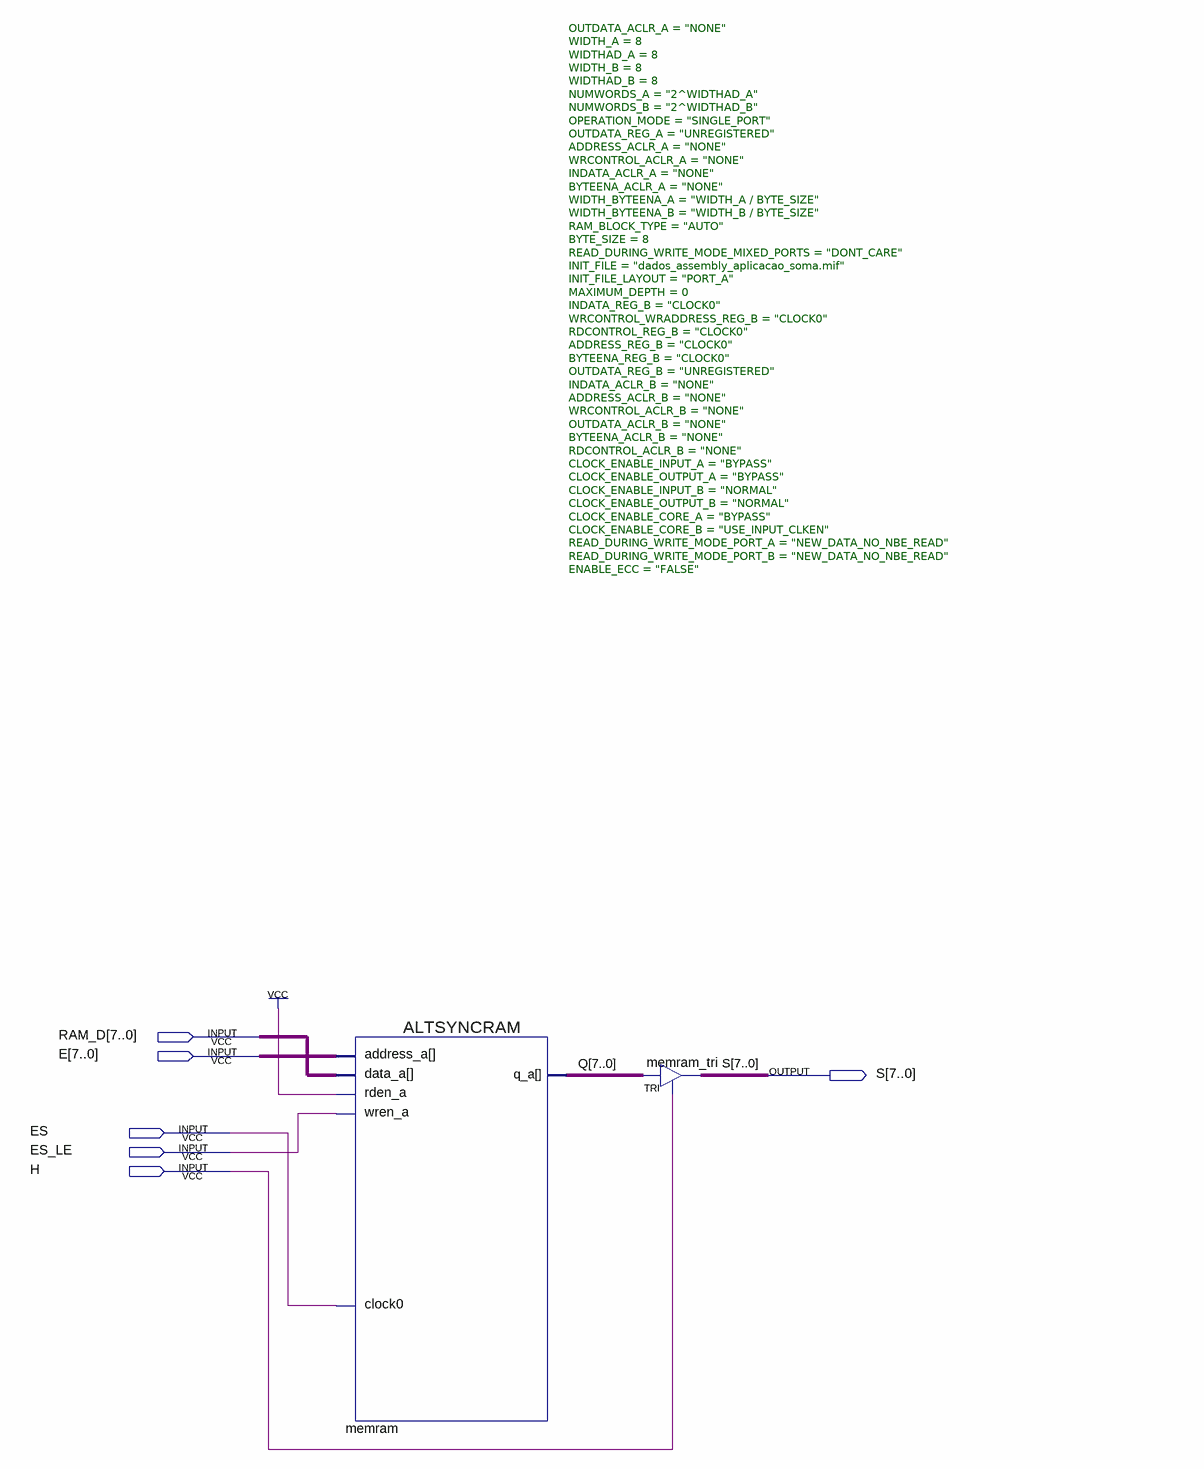
[diagram p0: schematic sheet]
// Quartus schematic RAM_MemoriaRAM.bdf as structural Verilog: 2 symbols, 6 pins
module RAM_MemoriaRAM (
  input  [7:0] RAM_D,
  input  [7:0] E,
  input  ES,
  input  ES_LE,
  input  H,
  output [7:0] S
);

  wire [7:0] Q;

  ALTSYNCRAM #(.OUTDATA_ACLR_A("NONE"), .WIDTH_A(8), .WIDTHAD_A(8), .WIDTH_B(8), .WIDTHAD_B(8), .NUMWORDS_A("2^WIDTHAD_A"), .NUMWORDS_B("2^WIDTHAD_B"), .OPERATION_MODE("SINGLE_PORT"), .OUTDATA_REG_A("UNREGISTERED"), .ADDRESS_ACLR_A("NONE"), .WRCONTROL_ACLR_A("NONE"), .INDATA_ACLR_A("NONE"), .BYTEENA_ACLR_A("NONE"), .WIDTH_BYTEENA_A("WIDTH_A / BYTE_SIZE"), .WIDTH_BYTEENA_B("WIDTH_B / BYTE_SIZE"), .RAM_BLOCK_TYPE("AUTO"), .BYTE_SIZE(8), .READ_DURING_WRITE_MODE_MIXED_PORTS("DONT_CARE"), .INIT_FILE("dados_assembly_aplicacao_soma.mif"), .INIT_FILE_LAYOUT("PORT_A"), .MAXIMUM_DEPTH(0), .INDATA_REG_B("CLOCK0"), .WRCONTROL_WRADDRESS_REG_B("CLOCK0"), .RDCONTROL_REG_B("CLOCK0"), .ADDRESS_REG_B("CLOCK0"), .BYTEENA_REG_B("CLOCK0"), .OUTDATA_REG_B("UNREGISTERED"), .INDATA_ACLR_B("NONE"), .ADDRESS_ACLR_B("NONE"), .WRCONTROL_ACLR_B("NONE"), .OUTDATA_ACLR_B("NONE"), .BYTEENA_ACLR_B("NONE"), .RDCONTROL_ACLR_B("NONE"), .CLOCK_ENABLE_INPUT_A("BYPASS"), .CLOCK_ENABLE_OUTPUT_A("BYPASS"), .CLOCK_ENABLE_INPUT_B("NORMAL"), .CLOCK_ENABLE_OUTPUT_B("NORMAL"), .CLOCK_ENABLE_CORE_A("BYPASS"), .CLOCK_ENABLE_CORE_B("USE_INPUT_CLKEN"), .READ_DURING_WRITE_MODE_PORT_A("NEW_DATA_NO_NBE_READ"), .READ_DURING_WRITE_MODE_PORT_B("NEW_DATA_NO_NBE_READ"), .ENABLE_ECC("FALSE")) memram (
    .address_a(E), .wren_a(ES_LE), .clock0(ES), .data_a(RAM_D), .rden_a(1'b1), .q_a(Q));
  TRI memram_tri[7:0] (.IN(Q), .OE(H), .OUT(S));
endmodule
